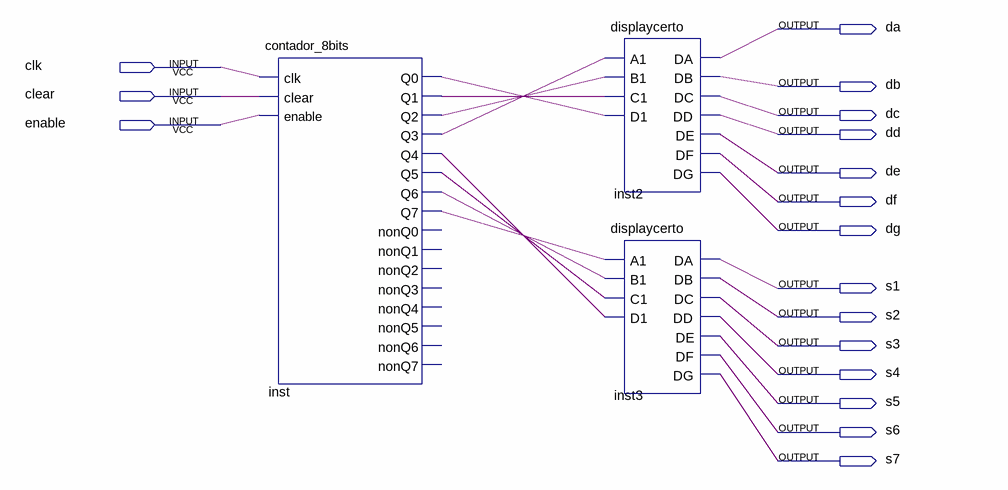
[diagram p0: schematic sheet]
// Quartus schematic display.bdf as structural Verilog: 3 symbols, 17 pins
module display (
  input  clk,
  input  clear,
  input  enable,
  output da,
  output db,
  output dc,
  output dd,
  output de,
  output df,
  output dg,
  output s1,
  output s2,
  output s3,
  output s4,
  output s5,
  output s6,
  output s7
);

  wire inst_q0, inst_q1, inst_q2, inst_q3, inst_q4, inst_q5, inst_q6, inst_q7;

  contador_8bits inst (
    .clk(clk), .clear(clear), .enable(enable), .Q0(inst_q0), .Q1(inst_q1), .Q2(inst_q2), .Q3(inst_q3),
    .Q4(inst_q4), .Q5(inst_q5), .Q6(inst_q6), .Q7(inst_q7));  // open: nonQ0, nonQ1, nonQ2, nonQ3, nonQ4, nonQ5, nonQ6, nonQ7
  displaycerto inst2 (
    .A1(inst_q3), .B1(inst_q2), .C1(inst_q1), .D1(inst_q0), .DA(da), .DB(db), .DC(dc), .DD(dd), .DE(de),
    .DF(df), .DG(dg));
  displaycerto inst3 (
    .A1(inst_q7), .B1(inst_q6), .C1(inst_q5), .D1(inst_q4), .DA(s1), .DB(s2), .DC(s3), .DD(s4), .DE(s5),
    .DF(s6), .DG(s7));
endmodule
